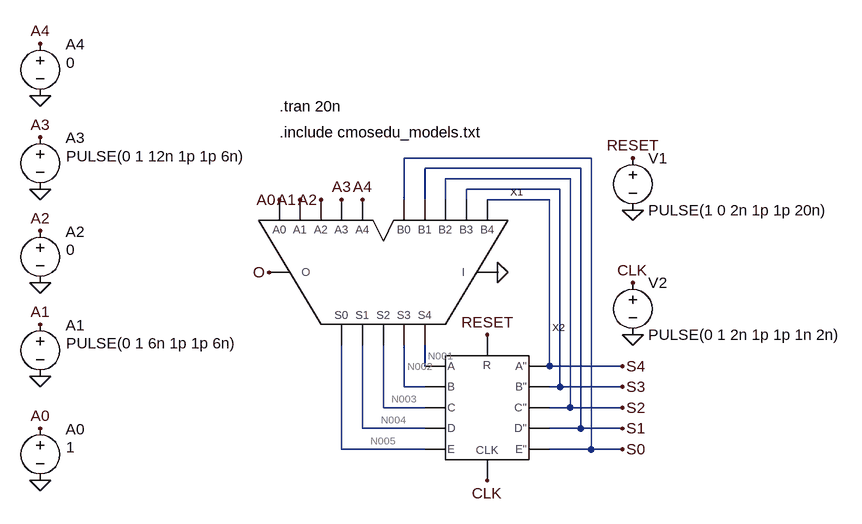
[diagram p0: schematic main.asc]
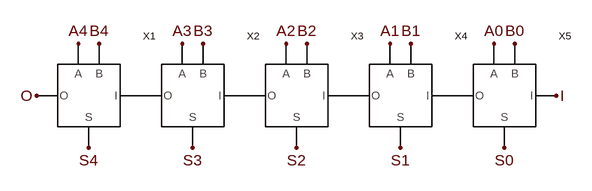
[diagram p1: sub-circuit fulladder5.asc]
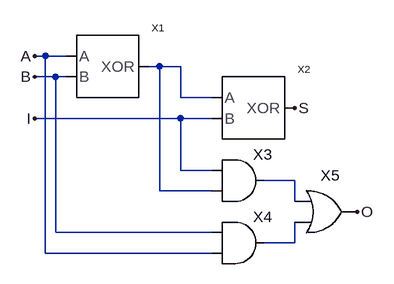
[diagram p2: sub-circuit fulladder.asc]
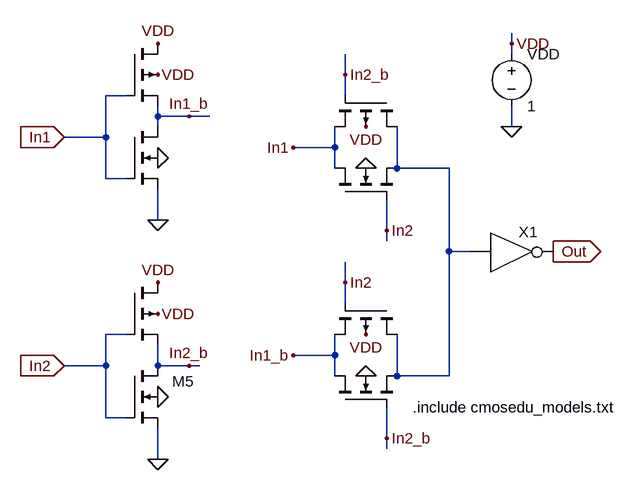
[diagram p3: sub-circuit xor.asc]
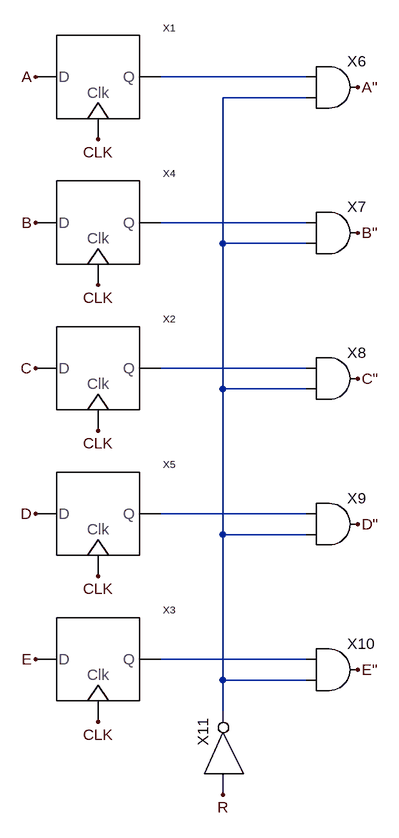
[diagram p4: sub-circuit dff_5.asc]
main.asc, the LTspice schematic file:
Version 4
SHEET 1 932 824
WIRE 208 176 -80 176
WIRE 192 192 -48 192
WIRE 176 208 -16 208
WIRE 160 224 16 224
WIRE -80 240 -80 176
WIRE -48 240 -48 192
WIRE -16 240 -16 208
WIRE 16 240 16 224
WIRE 144 240 48 240
WIRE -48 496 -48 464
WIRE 144 496 144 240
WIRE 256 496 144 496
WIRE -80 528 -80 464
WIRE -48 528 -80 528
WIRE 160 528 160 224
WIRE 160 528 144 528
WIRE 256 528 160 528
WIRE -112 560 -112 464
WIRE -48 560 -112 560
WIRE 176 560 176 208
WIRE 176 560 144 560
WIRE 256 560 176 560
WIRE -144 592 -144 464
WIRE -48 592 -144 592
WIRE 192 592 192 192
WIRE 192 592 144 592
WIRE 256 592 192 592
WIRE -176 624 -176 464
WIRE -48 624 -176 624
WIRE 208 624 208 176
WIRE 208 624 144 624
WIRE 256 624 208 624
FLAG 64 352 0
FLAG 256 496 S4
FLAG 256 528 S3
FLAG 256 560 S2
FLAG 256 592 S1
FLAG 256 624 S0
FLAG 272 256 0
FLAG 272 176 RESET
FLAG 48 448 RESET
FLAG 272 448 0
FLAG 272 368 CLK
FLAG 48 672 CLK
FLAG -640 672 0
FLAG -640 592 A0
FLAG -640 512 0
FLAG -640 432 A1
FLAG -176 240 A3
FLAG -144 240 A4
FLAG -640 368 0
FLAG -640 288 A2
FLAG -640 224 0
FLAG -640 144 A3
FLAG -640 80 0
FLAG -640 0 A4
FLAG -288 352 O
FLAG -208 240 A2
FLAG -272 240 A0
FLAG -240 240 A1
SYMBOL FULLADDER5 -112 352 R0
SYMATTR InstName X1
SYMBOL DFF_5 48 560 R0
SYMATTR InstName X2
SYMBOL voltage 272 160 R0
WINDOW 123 0 0 Left 0
WINDOW 39 0 0 Left 0
SYMATTR InstName V1
SYMATTR Value PULSE(1 0 2n 1p 1p 20n)
SYMBOL voltage 272 352 R0
WINDOW 123 0 0 Left 0
WINDOW 39 0 0 Left 0
SYMATTR InstName V2
SYMATTR Value PULSE(0 1 2n 1p 1p 1n 2n)
SYMBOL voltage -640 576 R0
WINDOW 0 39 17 Left 2
WINDOW 3 40 45 Left 2
WINDOW 123 0 0 Left 0
WINDOW 39 0 0 Left 0
SYMATTR InstName A0
SYMATTR Value 1
SYMBOL voltage -640 416 R0
WINDOW 0 39 17 Left 2
WINDOW 3 40 45 Left 2
WINDOW 123 0 0 Left 0
WINDOW 39 0 0 Left 0
SYMATTR InstName A1
SYMATTR Value PULSE(0 1 6n 1p 1p 6n)
SYMBOL voltage -640 272 R0
WINDOW 0 39 17 Left 2
WINDOW 3 40 45 Left 2
WINDOW 123 0 0 Left 0
WINDOW 39 0 0 Left 0
SYMATTR InstName A2
SYMATTR Value 0
SYMBOL voltage -640 128 R0
WINDOW 0 39 17 Left 2
WINDOW 3 40 45 Left 2
WINDOW 123 0 0 Left 0
WINDOW 39 0 0 Left 0
SYMATTR InstName A3
SYMATTR Value PULSE(0 1 12n 1p 1p 6n)
SYMBOL voltage -640 -16 R0
WINDOW 0 39 17 Left 2
WINDOW 3 40 45 Left 2
WINDOW 123 0 0 Left 0
WINDOW 39 0 0 Left 0
SYMATTR InstName A4
SYMATTR Value 0
TEXT -272 96 Left 2 !.tran 20n
TEXT -272 136 Left 2 !.include cmosedu_models.txt

fulladder5.asc, the sub-circuit schematic file:
Version 4
SHEET 1 880 680
FLAG 0 192 O
FLAG 704 112 A0
FLAG 544 112 A1
FLAG 384 112 A2
FLAG 224 112 A3
FLAG 64 112 A4
FLAG 720 272 S0
FLAG 560 272 S1
FLAG 400 272 S2
FLAG 240 272 S3
FLAG 80 272 S4
FLAG 736 112 B0
FLAG 576 112 B1
FLAG 416 112 B2
FLAG 256 112 B3
FLAG 96 112 B4
FLAG 800 192 I
SYMBOL FULLADDER 80 192 R0
SYMATTR InstName X1
SYMBOL FULLADDER 240 192 R0
SYMATTR InstName X2
SYMBOL FULLADDER 400 192 R0
SYMATTR InstName X3
SYMBOL FULLADDER 560 192 R0
SYMATTR InstName X4
SYMBOL FULLADDER 720 192 R0
SYMATTR InstName X5

fulladder.asc, the sub-circuit schematic file:
Version 4
SHEET 1 880 680
WIRE 64 128 48 128
WIRE 96 128 64 128
WIRE 240 144 224 144
WIRE 272 144 240 144
WIRE 80 160 48 160
WIRE 96 160 80 160
WIRE 272 192 272 144
WIRE 320 192 272 192
WIRE 272 224 48 224
WIRE 320 224 272 224
WIRE 272 304 272 224
WIRE 320 304 272 304
WIRE 448 320 400 320
WIRE 240 336 240 144
WIRE 320 336 240 336
WIRE 448 352 448 320
WIRE 80 400 80 160
WIRE 320 400 80 400
WIRE 448 416 448 384
WIRE 448 416 400 416
WIRE 64 432 64 128
WIRE 320 432 64 432
FLAG 48 128 A
FLAG 48 160 B
FLAG 48 224 I
FLAG 448 208 S
FLAG 544 368 O
SYMBOL AND2 368 256 R0
SYMATTR InstName X3
SYMBOL AND2 368 352 R0
SYMATTR InstName X4
SYMBOL OR2 496 304 R0
SYMATTR InstName X5
SYMBOL XOR 160 144 R0
SYMATTR InstName X1
SYMBOL XOR 384 208 R0
SYMATTR InstName X2

xor.asc, the sub-circuit schematic file:
Version 4
SHEET 1 1820 680
WIRE 1152 -832 1152 -848
WIRE 1152 -816 1152 -832
WIRE 896 -784 896 -816
WIRE 560 -752 528 -752
WIRE 896 -752 896 -784
WIRE 608 -720 608 -736
WIRE 656 -720 608 -720
WIRE 688 -720 656 -720
WIRE 608 -704 608 -720
WIRE 1152 -704 1152 -736
WIRE 528 -688 528 -752
WIRE 528 -688 464 -688
WIRE 880 -672 880 -704
WIRE 880 -672 816 -672
WIRE 880 -640 880 -672
WIRE 976 -640 976 -704
WIRE 1056 -640 976 -640
WIRE 528 -624 528 -688
WIRE 560 -624 528 -624
WIRE 608 -560 608 -608
WIRE 960 -544 960 -592
WIRE 960 -528 960 -544
WIRE 1056 -512 1056 -640
WIRE 1088 -512 1056 -512
WIRE 896 -464 896 -496
WIRE 896 -432 896 -464
WIRE 560 -384 528 -384
WIRE 880 -352 880 -384
WIRE 880 -352 816 -352
WIRE 528 -336 528 -384
WIRE 528 -336 464 -336
WIRE 608 -336 608 -368
WIRE 656 -336 608 -336
WIRE 672 -336 656 -336
WIRE 880 -320 880 -352
WIRE 976 -320 976 -384
WIRE 1056 -320 1056 -512
WIRE 1056 -320 976 -320
WIRE 528 -256 528 -336
WIRE 560 -256 528 -256
WIRE 960 -224 960 -272
WIRE 960 -208 960 -224
WIRE 608 -192 608 -240
FLAG 608 -656 0
FLAG 1152 -704 0
FLAG 1152 -832 VDD
FLAG 608 -784 VDD
FLAG 608 -560 0
FLAG 608 -832 VDD
FLAG 608 -288 0
FLAG 608 -416 VDD
FLAG 608 -192 0
FLAG 608 -464 VDD
FLAG 928 -320 0
FLAG 928 -384 VDD
FLAG 928 -640 0
FLAG 928 -704 VDD
FLAG 1216 -512 Out
IOPIN 1216 -512 Out
FLAG 464 -688 In1
IOPIN 464 -688 In
FLAG 464 -336 In2
IOPIN 464 -336 In
FLAG 656 -720 In1_b
FLAG 656 -336 In2_b
FLAG 896 -784 In2_b
FLAG 896 -464 In2
FLAG 960 -544 In2
FLAG 960 -224 In2_b
FLAG 816 -352 In1_b
FLAG 816 -672 In1
SYMBOL nmos4 560 -704 R0
WINDOW 0 104 24 Invisible 2
WINDOW 3 179 41 Invisible 2
SYMATTR InstName M1
SYMATTR Value N_50n
SYMATTR Value2 l=50n w=500n
SYMBOL voltage 1152 -832 R0
WINDOW 123 24 126 Left 2
WINDOW 39 24 111 Left 2
SYMATTR InstName VDD
SYMATTR Value 1
SYMBOL pmos4 560 -832 R0
WINDOW 0 88 9 Invisible 2
WINDOW 3 168 20 Invisible 2
SYMATTR InstName M2
SYMATTR Value P_50n
SYMATTR Value2 l=50n w=1u
SYMBOL nmos4 560 -336 R0
WINDOW 0 104 24 Right 2
WINDOW 3 179 41 Invisible 2
SYMATTR InstName M5
SYMATTR Value N_50n
SYMATTR Value2 l=50n w=500n
SYMBOL pmos4 560 -464 R0
WINDOW 0 88 9 Invisible 2
WINDOW 3 168 20 Invisible 2
SYMATTR InstName M6
SYMATTR Value P_50n
SYMATTR Value2 l=50n w=1u
SYMBOL nmos4 880 -272 R270
WINDOW 0 86 42 Invisible 2
WINDOW 3 82 140 Invisible 2
SYMATTR InstName M7
SYMATTR Value N_50n
SYMATTR Value2 l=50n w=500n
SYMBOL pmos4 976 -432 R90
WINDOW 0 71 26 Invisible 2
WINDOW 3 75 133 Invisible 2
SYMATTR InstName M3
SYMATTR Value P_50n
SYMATTR Value2 l=50n w=1u
SYMBOL nmos4 880 -592 R270
WINDOW 0 86 42 Invisible 2
WINDOW 3 82 140 Invisible 2
SYMATTR InstName M13
SYMATTR Value N_50n
SYMATTR Value2 l=50n w=500n
SYMBOL pmos4 976 -752 R90
WINDOW 0 71 26 Invisible 2
WINDOW 3 75 133 Invisible 2
SYMATTR InstName M14
SYMATTR Value P_50n
SYMATTR Value2 l=50n w=1u
SYMBOL NOT 1120 -544 R0
SYMATTR InstName X1
TEXT 1000 -272 Left 2 !.include cmosedu_models.txt

dff_5.asc, the sub-circuit schematic file:
Version 4
SHEET 1 892 1192
WIRE 240 -112 16 -112
WIRE 240 -80 112 -80
WIRE 240 112 16 112
WIRE 112 144 112 -80
WIRE 240 144 112 144
WIRE 240 336 16 336
WIRE 112 368 112 144
WIRE 240 368 112 368
WIRE 240 560 16 560
WIRE 112 592 112 368
WIRE 240 592 112 592
WIRE 240 784 16 784
WIRE 112 816 112 592
WIRE 240 816 112 816
WIRE 112 864 112 816
FLAG -176 -112 A
FLAG -176 112 B
FLAG -176 336 C
FLAG -176 560 D
FLAG -176 784 E
FLAG 320 -96 A"
FLAG 320 128 B"
FLAG 320 352 C"
FLAG 320 576 D"
FLAG 320 800 E"
FLAG -80 -16 CLK
FLAG -80 208 CLK
FLAG -80 432 CLK
FLAG -80 656 CLK
FLAG -80 880 CLK
FLAG 112 992 R
SYMBOL D_FF -80 -112 R0
SYMATTR InstName X1
SYMBOL D_FF -80 336 R0
SYMATTR InstName X2
SYMBOL D_FF -80 784 R0
SYMATTR InstName X3
SYMBOL D_FF -80 112 R0
SYMATTR InstName X4
SYMBOL D_FF -80 560 R0
SYMATTR InstName X5
SYMBOL AND2 288 -160 R0
SYMATTR InstName X6
SYMBOL AND2 288 64 R0
SYMATTR InstName X7
SYMBOL AND2 288 288 R0
SYMATTR InstName X8
SYMBOL AND2 288 512 R0
SYMATTR InstName X9
SYMBOL AND2 288 736 R0
SYMATTR InstName X10
SYMBOL NOT 80 960 R270
SYMATTR InstName X11

The netlist it stands for:
* main.asc
XX1 A0 A1 A2 A3 A4 S0 S1 S2 S3 S4 N005 N004 N003 N002 N001 0 O fulladder5
XX2 N001 N002 N003 N004 N005 S4 S3 S2 S1 S0 CLK RESET dff_5
V1 RESET 0 PULSE(1 0 2n 1p 1p 20n)
V2 CLK 0 PULSE(0 1 2n 1p 1p 1n 2n)
V§A0 A0 0 1
V§A1 A1 0 PULSE(0 1 6n 1p 1p 6n)
V§A2 A2 0 0
V§A3 A3 0 PULSE(0 1 12n 1p 1p 6n)
V§A4 A4 0 0

* block symbol definitions
.subckt fulladder5 A0 A1 A2 A3 A4 B0 B1 B2 B3 B4 S0 S1 S2 S3 S4 I O
XX1 A4 B4 O P001 S4 fulladder
XX2 A3 B3 P001 P002 S3 fulladder
XX3 A2 B2 P002 P003 S2 fulladder
XX4 A1 B1 P003 P004 S1 fulladder
XX5 A0 B0 P004 I S0 fulladder
.ends fulladder5

.subckt fulladder A B O I S
XX3 I N001 N002 AND2  ; pins In1 In2 Out
XX4 B A N003 AND2  ; pins In1 In2 Out
XX5 N002 N003 O OR2  ; pins In1 In2 Out
XX1 N001 A B xor
XX2 S N001 I xor
.ends fulladder

.subckt xor Out In1 In2
M1 In1_b In1 0 0 N_50n l=50n w=500n
VDD VDD 0 1
M2 VDD In1 In1_b VDD P_50n l=50n w=1u
M5 In2_b In2 0 0 N_50n l=50n w=500n
M6 VDD In2 In2_b VDD P_50n l=50n w=1u
M7 In1_b In2_b N001 0 N_50n l=50n w=500n
M3 N001 In2 In1_b VDD P_50n l=50n w=1u
M13 In1 In2 N001 0 N_50n l=50n w=500n
M14 N001 In2_b In1 VDD P_50n l=50n w=1u
XX1 N001 Out NOT  ; pins In Out
.include cmosedu_models.txt
.ends xor

.subckt dff_5 A B C D E A" B" C" D" E" CLK R
XX1 A N001 CLK D_FF  ; pins D Q clock
XX2 C N004 CLK D_FF  ; pins D Q clock
XX3 E N006 CLK D_FF  ; pins D Q clock
XX4 B N003 CLK D_FF  ; pins D Q clock
XX5 D N005 CLK D_FF  ; pins D Q clock
XX6 N001 N002 A" AND2  ; pins In1 In2 Out
XX7 N003 N002 B" AND2  ; pins In1 In2 Out
XX8 N004 N002 C" AND2  ; pins In1 In2 Out
XX9 N005 N002 D" AND2  ; pins In1 In2 Out
XX10 N006 N002 E" AND2  ; pins In1 In2 Out
XX11 R N002 NOT  ; pins In Out
.ends dff_5

.model NMOS NMOS
.model PMOS PMOS
.lib standard.mos
.tran 20n
.include cmosedu_models.txt
.backanno
.end

* Results of the author's LTspice run, read from the files saved beside the schematic
* Operating Point, zero values left out:
*   V(s4) = 77.34 µV
*   V(o) = 19.6 µV
*   V(n001) = 52.08 µV
*   V(s3) = 77.34 µV
*   V(n002) = 52.08 µV
*   V(s2) = 77.34 µV
*   V(n003) = 52.08 µV
*   V(s1) = 77.34 µV
*   V(n004) = 52.08 µV
*   V(a0) = 1 V
*   V(s0) = 58.96 µV
*   V(n005) = 999.9 mV
*   V(reset) = 1 V
*   I(A4) = 56.62 nA
*   I(A3) = 56.62 nA
*   I(A2) = 56.62 nA
*   I(A1) = 56.62 nA
*   I(A0) = -26.77 nA
*   I(V2) = 112.2 nA
*   I(V1) = -12.88 nA
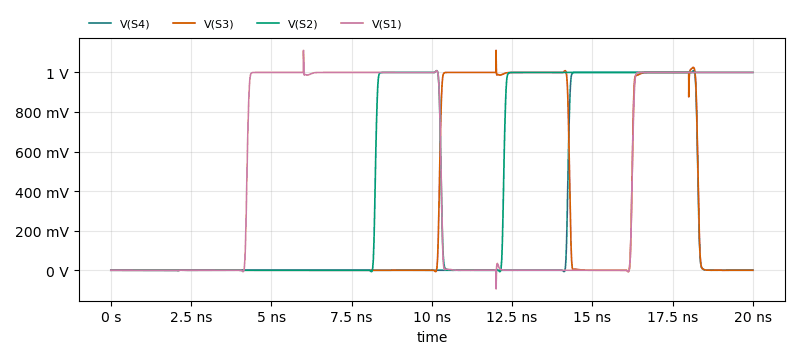
[diagram p5: Transient Analysis of main.asc, plotted from the saved traces]
* Transient Analysis, 1 run:
*   V(S4): min -6.896 mV, max 1.009 V, average 202.1 mV, rms 446.7 mV, last 76.37 µV
*   V(S3): min -6.891 mV, max 1.111 V, average 304.4 mV, rms 547.1 mV, last 76.5 µV
*   V(S2): min -6.936 mV, max 1.009 V, average 489.8 mV, rms 697.1 mV, last 1 V
*   V(S1): min -93.81 mV, max 1.111 V, average 489.8 mV, rms 697 mV, last 1 V